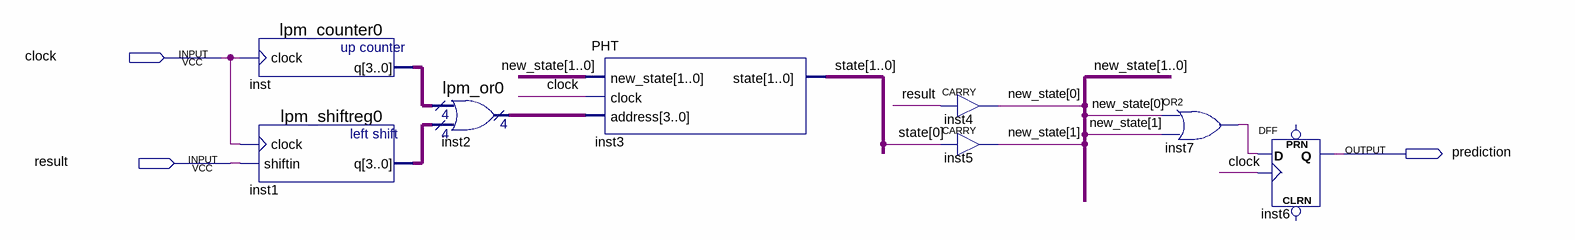
[diagram p0: schematic sheet]
// Quartus schematic Main.bdf as structural Verilog: 8 symbols, 3 pins
module Main (
  input  clock,
  input  result,
  output prediction
);

  wire inst7_out;
  wire [1:0] new_state, state;
  wire [3:0] inst1_q, inst2_result, inst_q;

  lpm_counter0 inst (.clock(clock), .q(inst_q));
  lpm_shiftreg0 inst1 (.clock(clock), .shiftin(result), .q(inst1_q));
  lpm_or0 inst2 (.data0x(inst_q), .data1x(inst1_q), .result(inst2_result));
  PHT inst3 (.new_state(new_state), .clock(clock), .address(inst2_result), .state(state));
  CARRY inst4 (.IN(result), .OUT(new_state[0]));
  CARRY inst5 (.IN(state[0]), .OUT(new_state[1]));
  or inst7 (inst7_out, new_state[0], new_state[1]);
  DFF inst6 (.CLK(clock), .D(inst7_out), .Q(prediction));  // open: CLRN, PRN
endmodule
